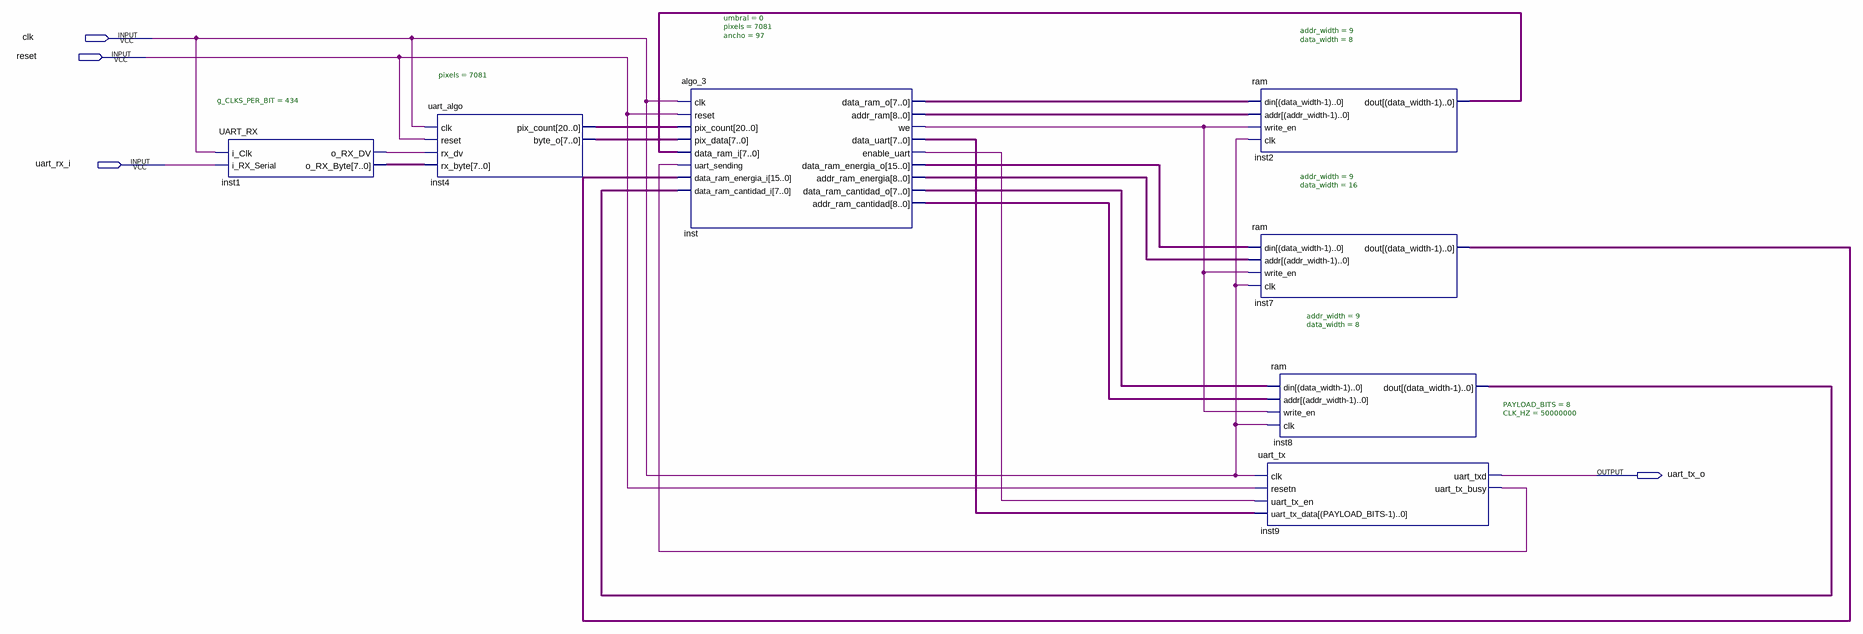
[diagram p0: schematic sheet]
// Quartus schematic anda_plis.bdf as structural Verilog: 7 symbols, 4 pins
module anda_plis (
  input  clk,
  input  reset,
  input  uart_rx_i,
  output uart_tx_o
);

  wire inst1_o_rx_dv, inst9_uart_tx_busy, inst_enable_uart, inst_we;
  wire [7:0] inst1_o_rx_byte, inst2_dout, inst4_byte_o, inst8_dout, inst_data_ram_cantidad_o,
       inst_data_ram_o, inst_data_uart;
  wire [8:0] inst_addr_ram, inst_addr_ram_cantidad, inst_addr_ram_energia;
  wire [15:0] inst7_dout, inst_data_ram_energia_o;
  wire [20:0] inst4_pix_count;

  UART_RX #(.g_CLKS_PER_BIT(434)) inst1 (
    .i_Clk(clk), .i_RX_Serial(uart_rx_i), .o_RX_DV(inst1_o_rx_dv), .o_RX_Byte(inst1_o_rx_byte));
  uart_algo #(.pixels(7081)) inst4 (
    .clk(clk), .reset(reset), .rx_dv(inst1_o_rx_dv), .rx_byte(inst1_o_rx_byte), .pix_count(inst4_pix_count),
    .byte_o(inst4_byte_o));
  algo_3 #(.umbral(0), .pixels(7081), .ancho(97)) inst (
    .clk(clk), .reset(reset), .pix_count(inst4_pix_count), .pix_data(inst4_byte_o), .data_ram_i(inst2_dout),
    .uart_sending(inst9_uart_tx_busy), .data_ram_energia_i(inst7_dout), .data_ram_cantidad_i(inst8_dout),
    .data_ram_o(inst_data_ram_o), .addr_ram(inst_addr_ram), .we(inst_we), .data_uart(inst_data_uart),
    .enable_uart(inst_enable_uart), .data_ram_energia_o(inst_data_ram_energia_o),
    .addr_ram_energia(inst_addr_ram_energia), .data_ram_cantidad_o(inst_data_ram_cantidad_o),
    .addr_ram_cantidad(inst_addr_ram_cantidad));
  ram #(.addr_width(9), .data_width(8)) inst2 (
    .din(inst_data_ram_o), .addr(inst_addr_ram), .write_en(inst_we), .clk(clk), .dout(inst2_dout));
  ram #(.addr_width(9), .data_width(16)) inst7 (
    .din(inst_data_ram_energia_o), .addr(inst_addr_ram_energia), .write_en(inst_we), .clk(clk),
    .dout(inst7_dout));
  ram #(.addr_width(9), .data_width(8)) inst8 (
    .din(inst_data_ram_cantidad_o), .addr(inst_addr_ram_cantidad), .write_en(inst_we), .clk(clk),
    .dout(inst8_dout));
  uart_tx #(.PAYLOAD_BITS(8), .CLK_HZ(50000000)) inst9 (
    .clk(clk), .resetn(reset), .uart_tx_en(inst_enable_uart), .uart_tx_data(inst_data_uart),
    .uart_txd(uart_tx_o), .uart_tx_busy(inst9_uart_tx_busy));
endmodule
